# EAGLE design side panel V5 (EAGLE 8.3.1)
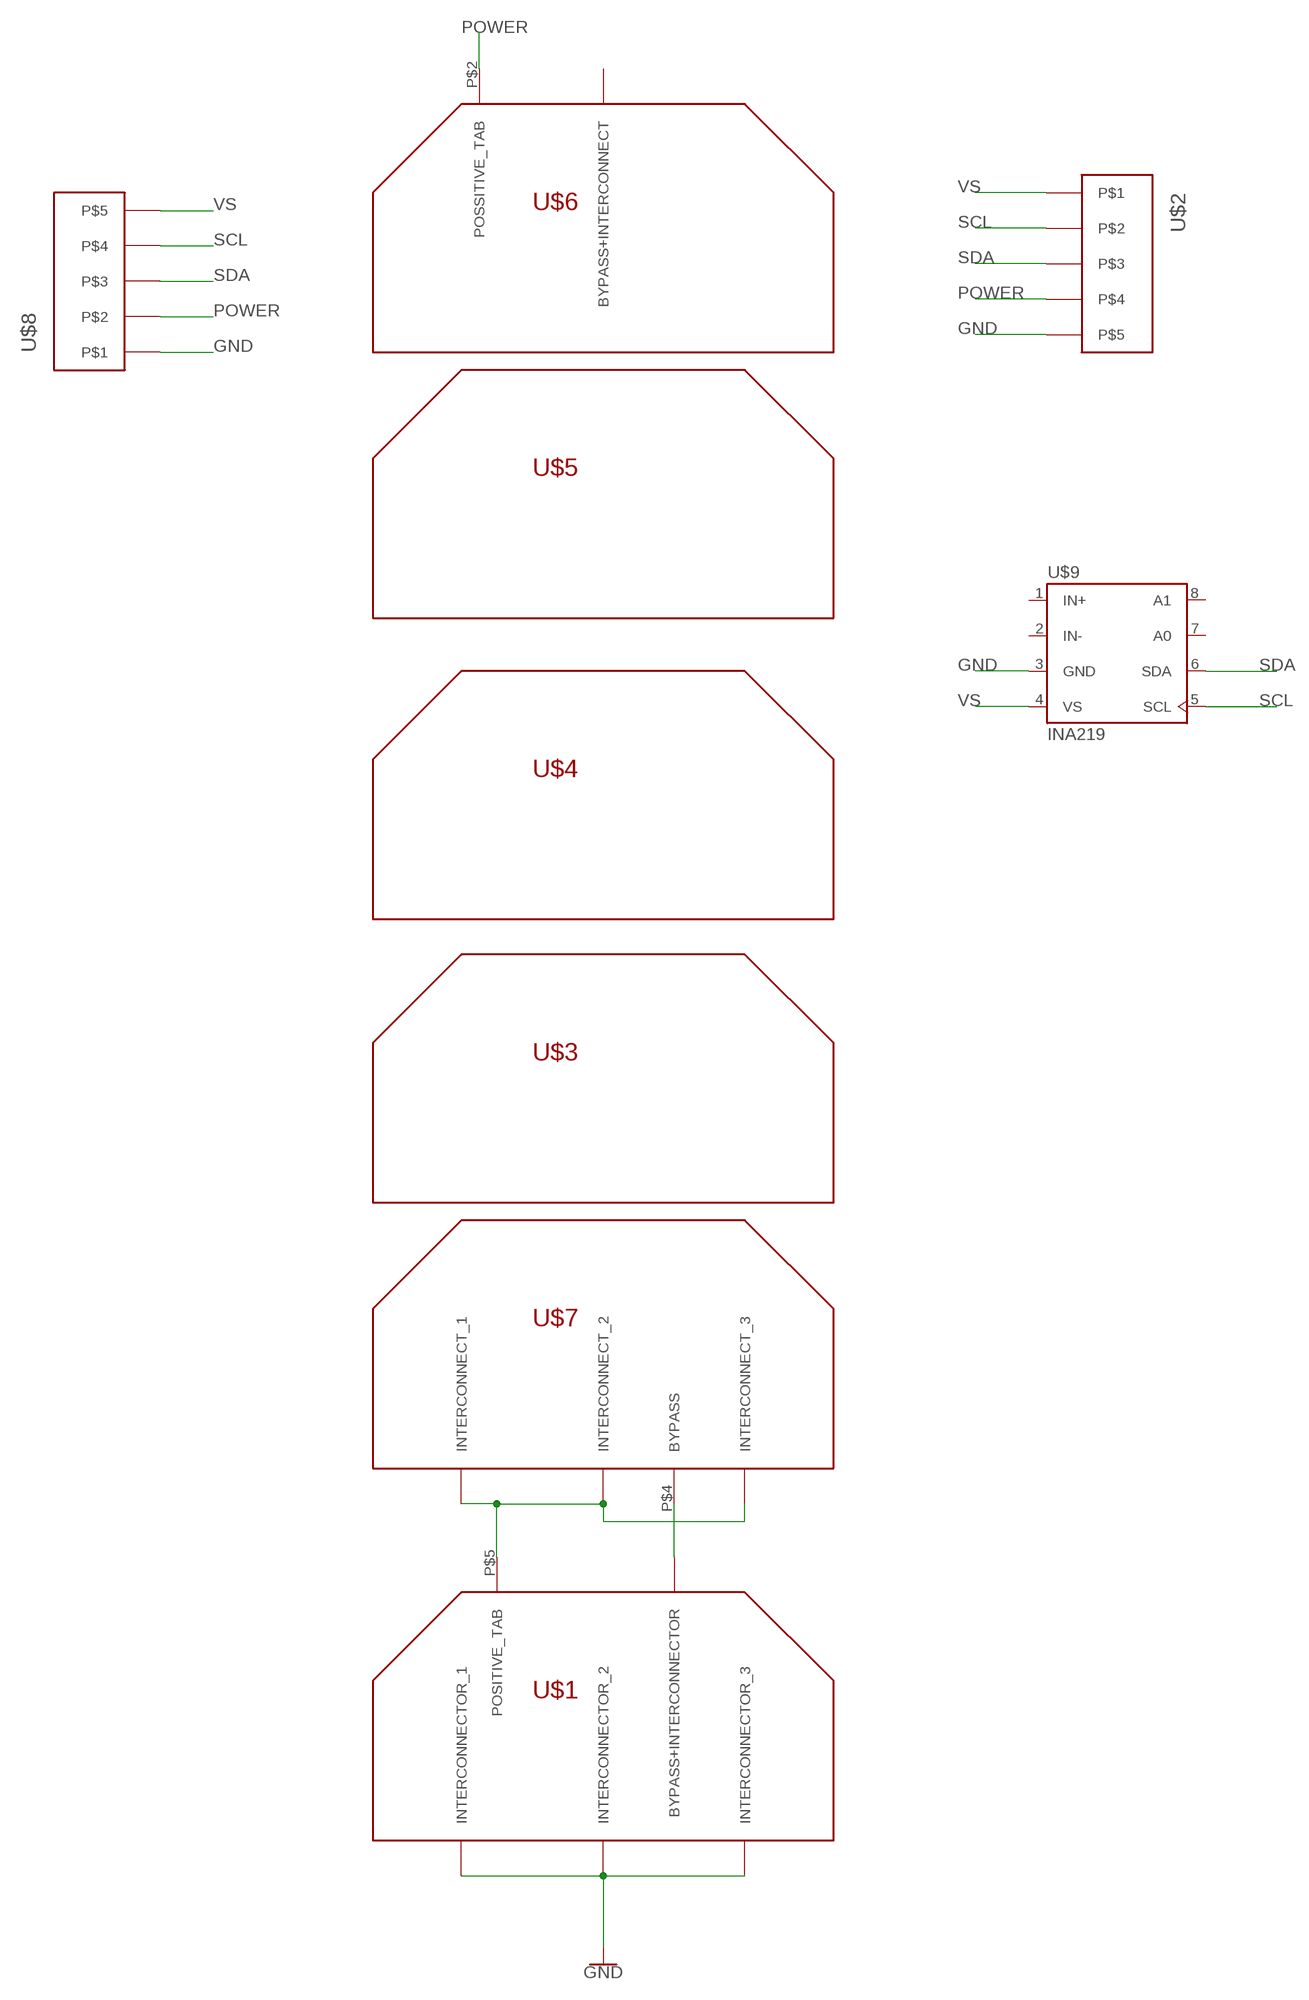
[diagram p0: schematic, sheet 1]

## Parts
U$1  SOLAR_CELL_STAND-ALONE  [SOLAR_CELL_STAND-ALONE]
U$2  PICOLOCK_5  [PICOLOCK_5]
U$3  SOALAR_CELL_OUTLINE  [SOLAR_CELL_OUTLINE]
U$4  SOALAR_CELL_OUTLINE  [SOLAR_CELL_OUTLINE]
U$5  SOALAR_CELL_OUTLINE  [SOLAR_CELL_OUTLINE]
U$6  SOLAR_CELL_TOP  [SOLAR_CELL_TOP_SHORT-PAD]
U$7  SOLAR_CELL_BOTTOM+BYPASS  [SOLAR_CELL_BOTTOM+BYPASS]
U$8  PICOLOCK_5  [PICOLOCK_5]
U$9  INA219  [S008]

## Nets
GND: U$1.P$1(INTERCONNECTOR_1) U$1.P$2(INTERCONNECTOR_2) U$1.P$3(INTERCONNECTOR_3) U$2.P$5 U$8.P$1 U$9.3(GND)
N$9: U$1.P$4(BYPASS+INTERCONNECTOR) U$7.P$4(BYPASS)
N$10: U$1.P$5(POSITIVE_TAB) U$7.P$1(INTERCONNECT_1) U$7.P$2(INTERCONNECT_2) U$7.P$3(INTERCONNECT_3)
POWER: U$2.P$4 U$6.P$2(POSSITIVE_TAB) U$8.P$2
SCL: U$2.P$2 U$8.P$4 U$9.5(SCL)
SDA: U$2.P$3 U$8.P$3 U$9.6(SDA)
VS: U$2.P$1 U$8.P$5 U$9.4(VS)
Unconnected: U$6.P$1(BYPASS+INTERCONNECT) U$9.1(IN+) U$9.2(IN-) U$9.7(A0) U$9.8(A1)

## Library data of the parts
U$1 = DubSat1 Components:SOLAR_CELL_STAND-ALONE
U$2 U$8 = DubSat1 Components:PICOLOCK_5
U$3-U$5 = DubSat1 Components:SOALAR_CELL_OUTLINE: Azurspace Solar Cell: http://www.azurspace.com/images/products/0003401-01-01_DB_3G30A.pdf Contains an outline of the solar cell without any pads because the interconnectors will be attached externaly and not on the board. This footprint is to be used as the center cells in a string of cells.
U$6 = DubSat1 Components:SOLAR_CELL_TOP: Azurspace solar cell: http://www.azurspace.com/images/products/0003401-01-01_DB_3G30A.pdf With outline of full cell + pad for top side introconnector and integrated bypass diode. To be used as the top cell in a string of cells.
U$7 = DubSat1 Components:SOLAR_CELL_BOTTOM+BYPASS
U$9 = DubSat1 Components:INA219: INA219 is an integrated voltage, current, and temperature sensor that comunicates over I2C. Datasheet: http://www.ti.com/lit/ds/symlink/ina219.pdf Used in Dubsat1 in the Power Gen Board and the Solar Panels.

## Board
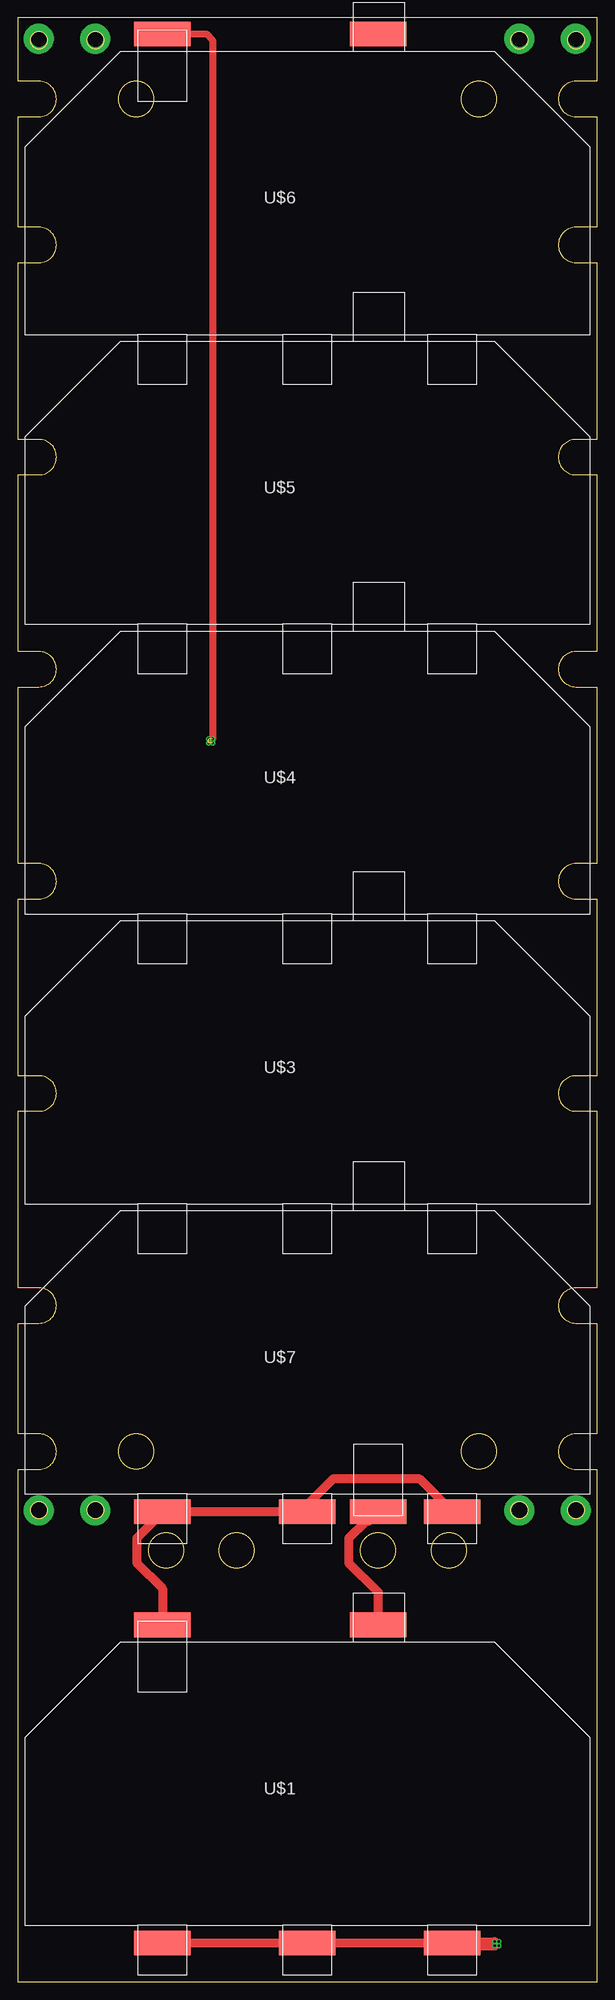
[diagram p1: board, top side]
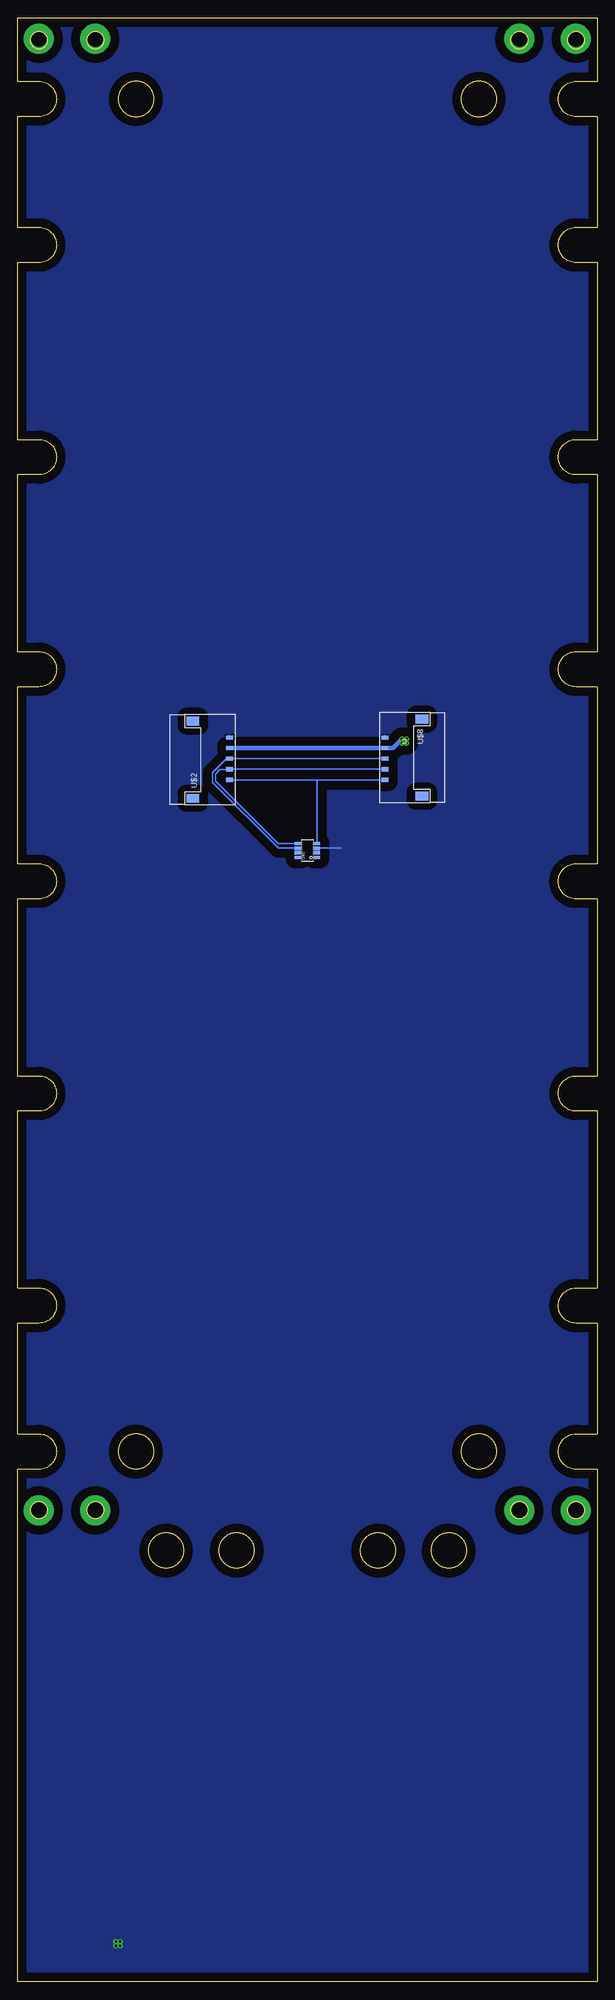
[diagram p2: board, bottom side, seen from below]

Size 82 x 277.8 mm. Coordinates in mm from the lower left corner, seen from the top.
Outline: 79,248.15 arc180 79,243.15 82,243.15 82,218.15 79,218.15 arc180 79,213.15 82,213.15 82,188.15 79,188.15 arc180 79,183.15 82,183.15 82,158.15 79,158.15 arc180 79,153.15 82,153.15 82,128.15 79,128.15 arc180 79,123.15 82,123.15 82,98.15 79,98.15 arc180 79,93.15 82,93.15 82,77.5 79,77.5 arc180 79,72.5 82,72.5 82,0 0,0 0,72.5 3,72.5 arc180 3,77.5 0,77.5 0,93.15 3,93.15 arc180 3,98.15 0,98.15 0,123.15 3,123.15 arc180 3,128.15 0,128.15 0,153.15 3,153.15 arc180 3,158.15 0,158.15 0,183.15 3,183.15 arc180 3,188.15 0,188.15 0,213.15 3,213.15 arc180 3,218.15 0,218.15 0,243.15 3,243.15 arc180 3,248.15 0,248.15 0,263.8 3,263.8 arc180 3,268.8 0,268.8 0,277.8 82,277.8 82,268.8 79,268.8 arc180 79,263.8 82,263.8 82,248.15 79,248.15
Outline: circle at 21,61 radius 2.5
Outline: circle at 65.26,75 radius 2.5
Outline: circle at 51,61 radius 2.5
Outline: circle at 65.26,266.3 radius 2.5
Outline: circle at 16.74,75 radius 2.5
Outline: circle at 16.74,266.3 radius 2.5
Outline: circle at 61,61 radius 2.5
Outline: circle at 31,61 radius 2.5
Outline: circle at 3,274.6 radius 1.19
Outline: circle at 11,274.6 radius 1.19
Outline: circle at 11,66.7 radius 1.19
Outline: circle at 3,66.7 radius 1.19
Outline: circle at 71,66.7 radius 1.19
Outline: circle at 79,66.7 radius 1.19
Outline: circle at 71,274.6 radius 1.19
Outline: circle at 79,274.6 radius 1.19
Copper layers (1*16): Top 0.035mm / dielectric 1.5mm / Bottom 0.035mm
Design rules "default": minimum track width 10mil, minimum drill 24mil, track to track 8mil, track to pad 8mil, pad to pad 8mil, via to via 8mil, smd to smd 8mil, copper to edge 40mil, drill to drill 8mil, minimum pad ring 10mil, minimum via ring 8mil, stop-mask expansion 4mil, vias tented up to drill 0mil, thermal gap 10mil

### Footprints (pad centres in the part's own frame; a part is rotated, then mirrored left to right if it is on the bottom)
SOLAR_CELL_STAND-ALONE = smd 8 x 3.5: P$1 19.5,-2.5; P$2 40,-2.5; P$3 60.5,-2.5; P$4 50,42.5; P$5 19.5,42.5
PICOLOCK_5 = smd 1.25 x 1.8: MNT@1 -2.605,5.2; MNT@2 8.305,5.2 | smd 0.6 x 1: P$1 0,0; P$2 1.5,0; P$3 3,0; P$4 4.5,0; P$5 6,0
SOLAR_CELL_TOP_SHORT-PAD = smd 8 x 3.5: P$1 50,42.5; P$2 19.5,42.5
SOLAR_CELL_BOTTOM+BYPASS = smd 8 x 3.5: P$1 19.5,-2.5; P$2 40,-2.5; P$3 60.5,-2.5; P$4 50,-2.5
S008 = smd 0.45 x 1: 1 -0.975,-1.3; 2 -0.325,-1.3; 3 0.325,-1.3; 4 0.975,-1.3; 5 0.975,1.3; 6 0.325,1.3; 7 -0.325,1.3; 8 -0.975,1.3

### Placement (x,y rotation side)
U$1  1,8 0 top
U$2  52,170 90 bottom
U$3  1,110 0 top
U$4  1,151 0 top
U$5  1,192 0 top
U$6  1,233 0 top
U$7  1,69 0 top
U$8  30,176 270 bottom
U$9  41,160 90 bottom

### Tracks (layer width: path | path; a pad name or v marks a point on that pad's centre or on a via)
GND  (via drill 0.3)
  Top 1.27: U$1.P$1 U$1.P$2 U$1.P$3 | U$1.P$3 61.7,5.7 v67.5,5.7 | U$1.P$3 61.9,5.1 v67.5,5.1
  Bottom 0.2: U$9.3 39.67,160.35 36.15,160.35
  other vias: 68.1,5.7 68.1,5.1
  pour Bottom (isolate 1.27): 0,0 0,277.8 82,277.8 82,0
N$1  (via drill 2.2 pad 4.24)
  other vias: 3,274.8
N$2  (via drill 2.2 pad 4.24)
  other vias: 11,274.8
N$3  (via drill 2.2 pad 4.24)
  other vias: 3,66.7
N$4  (via drill 2.2 pad 4.24)
  other vias: 11,66.7
N$5  (via drill 2.2 pad 4.24)
  other vias: 79,274.8
N$6  (via drill 2.2 pad 4.24)
  other vias: 71,274.8
N$7  (via drill 2.2 pad 4.24)
  other vias: 79,66.7
N$8  (via drill 2.2 pad 4.24)
  other vias: 71,66.7
N$9
  Top 1.27: U$7.P$4 49.65,65.15 49.28,65.15 46.85,62.72 46.85,59.28 51,55.13 U$1.P$4
N$10
  Top 1.27: U$1.P$5 20.5,55.63 16.85,59.28 16.85,62.72 20.5,66.37 U$7.P$1 U$7.P$2 41,67.5 44.6,71.1 56.9,71.1 U$7.P$3
POWER  (via drill 0.3)  (3 unrouted)
  Top 1.016: v27.6,175.8 27.6,274.6 26.7,275.5 U$6.P$2 21,276
  Bottom 0.61: v27.6,175.8 28.9,174.5 U$8.P$2 U$2.P$4
  other vias: 27,175.8 27,175.2 27.6,175.2
SCL
  Bottom 0.2: U$8.P$4 U$2.P$2 52.05,171.45 53.4,171.45 54,170.85 54,169.8 45.17,160.97 U$9.5
SDA
  Bottom 0.2: U$8.P$3 U$2.P$3 52.42,173 54.4,171.02 54.4,169.63 45.09,160.32 U$9.6
VS
  Bottom 0.2: 39.63,170 U$8.P$5 | 39.63,170 U$2.P$1 | U$9.4 39.63,161.04 39.63,170